# Altium schematic sheet UPCNSL-ABS-FLS-POL_test-v1.0.SchDoc
size A2
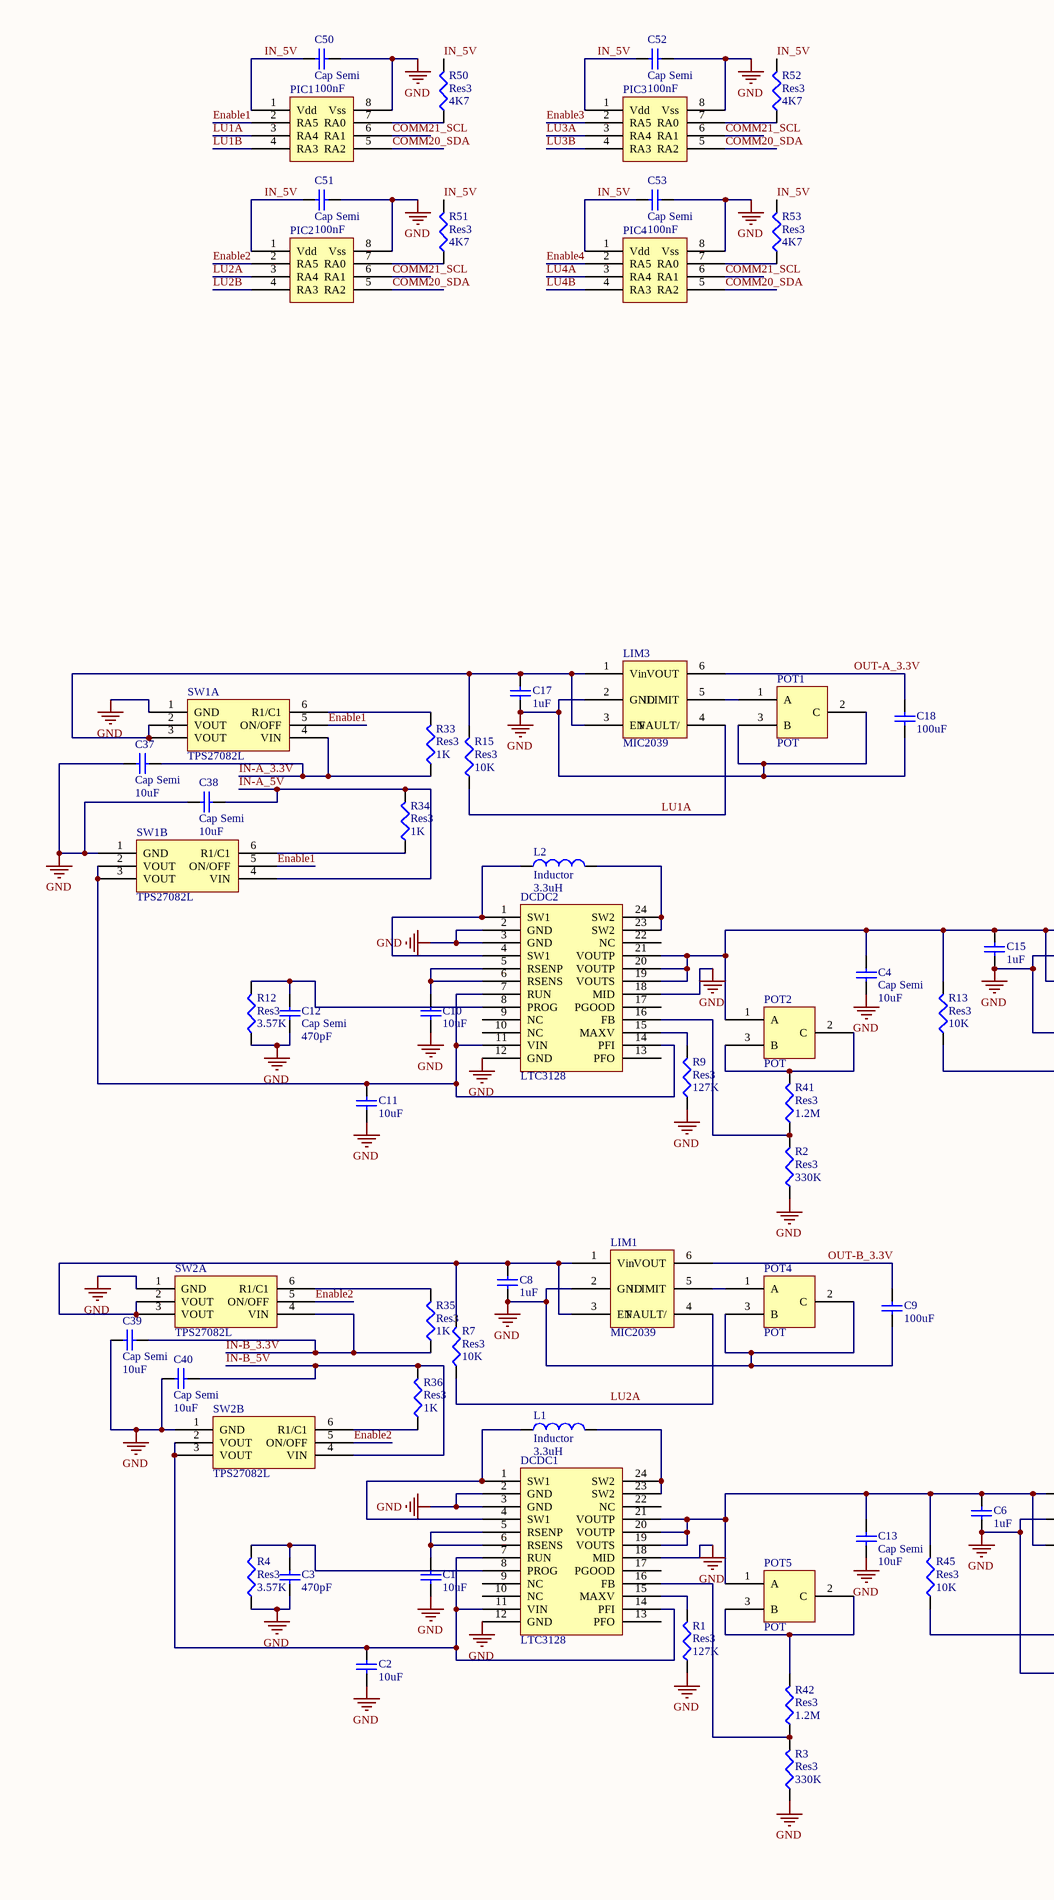
[diagram p0: UPCNSL-ABS-FLS-POL_test-v1.0.SchDoc, left]
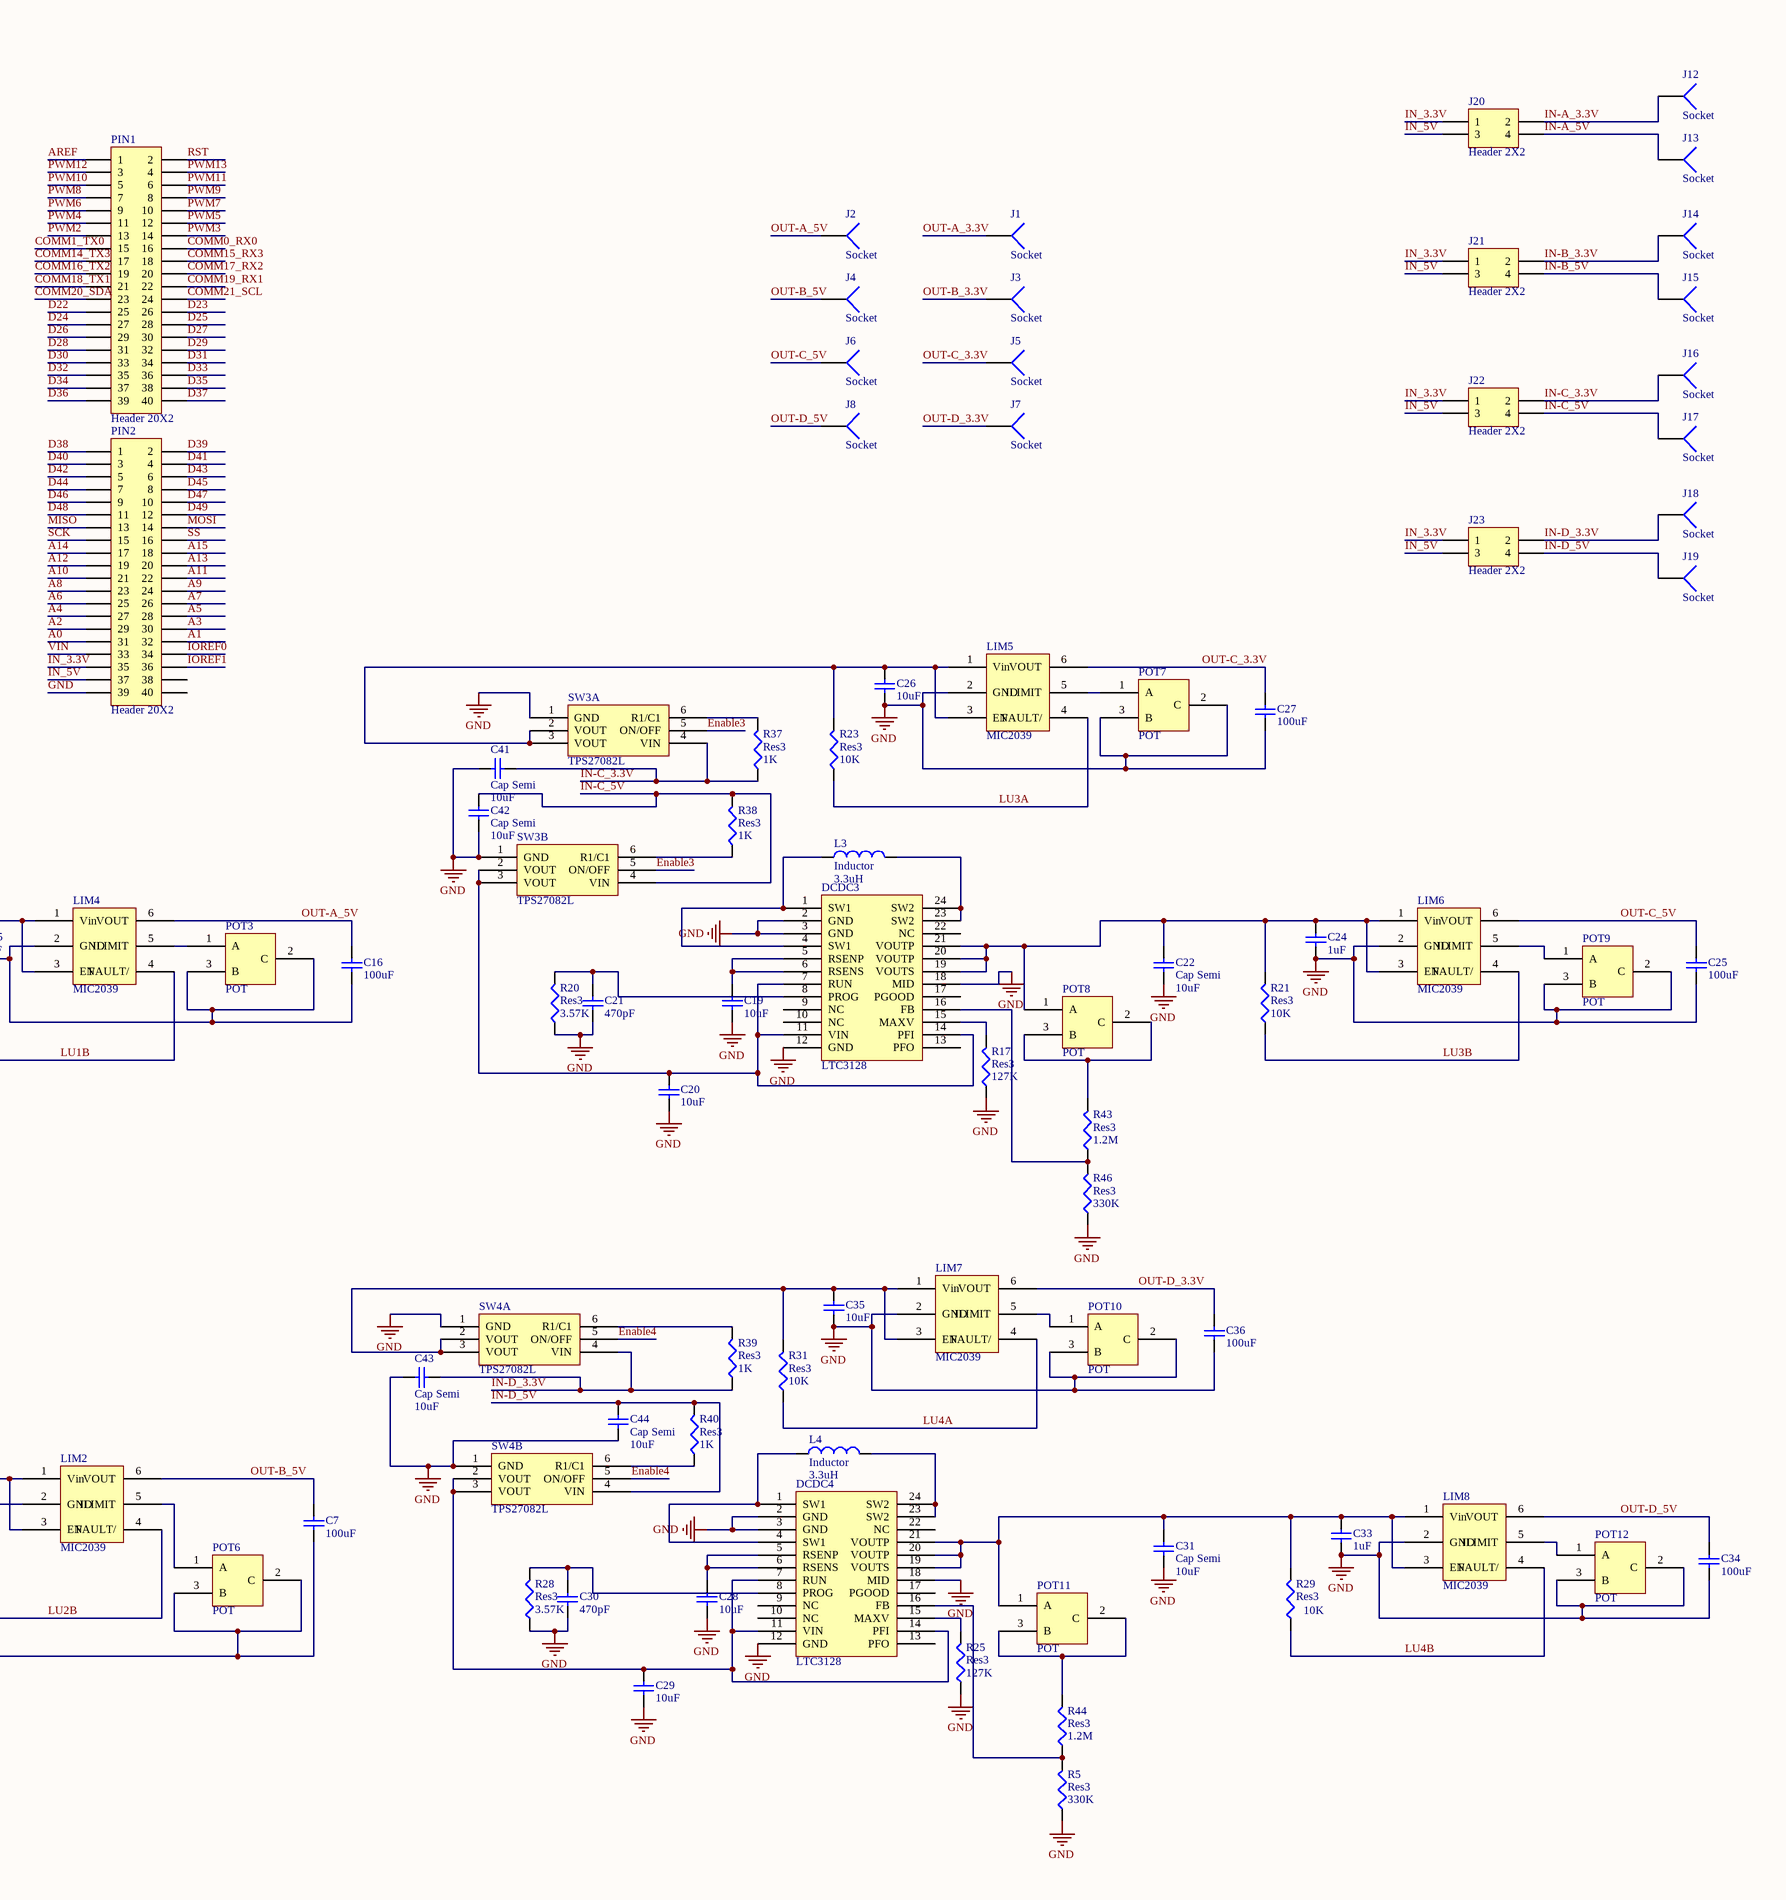
[diagram p1: UPCNSL-ABS-FLS-POL_test-v1.0.SchDoc, right]

## Parts
C1  value 10uF  [CAP0603]  (hidden comment: CAP0603)
C2  value 10uF  [CAP0603]  (hidden comment: CAP0603)
C3  value 470pF  [CAP0603]  (hidden comment: CAP0603)
C4  Cap Semi  value 10uF  [1608[0603]]
C6  value 1uF  [CAP0603]  (hidden comment: CAP0603)
C7  value 100uF  [CAP0603]  (hidden comment: CAP0603)
C8  value 1uF  [CAP0603]  (hidden comment: CAP0603)
C9  value 100uF  [CAP0603]  (hidden comment: CAP0603)
C10  value 10uF  [CAP0603]  (hidden comment: CAP0603)
C11  value 10uF  [CAP0603]  (hidden comment: CAP0603)
C12  Cap Semi  value 470pF  [1608[0603]]
C13  Cap Semi  value 10uF  [1608[0603]]
C15  value 1uF  [CAP0603]  (hidden comment: CAP0603)
C16  value 100uF  [CAP0603]  (hidden comment: CAP0603)
C17  value 1uF  [CAP0603]  (hidden comment: CAP0603)
C18  value 100uF  [CAP0603]  (hidden comment: CAP0603)
C19  value 10uF  [CAP0603]  (hidden comment: CAP0603)
C20  value 10uF  [CAP0603]  (hidden comment: CAP0603)
C21  value 470pF  [CAP0603]  (hidden comment: CAP0603)
C22  Cap Semi  value 10uF  [1608[0603]]
C24  value 1uF  [CAP0603]  (hidden comment: CAP0603)
C25  value 100uF  [CAP0603]  (hidden comment: CAP0603)
C26  value 10uF  [CAP0603]  (hidden comment: CAP0603)
C27  value 100uF  [CAP0603]  (hidden comment: CAP0603)
C28  value 10uF  [CAP0603]  (hidden comment: CAP0603)
C29  value 10uF  [CAP0603]  (hidden comment: CAP0603)
C30  value 470pF  [CAP0603]  (hidden comment: CAP0603)
C31  Cap Semi  value 10uF  [1608[0603]]
C33  value 1uF  [CAP0603]  (hidden comment: CAP0603)
C34  value 100uF  [CAP0603]  (hidden comment: CAP0603)
C35  value 10uF  [CAP0603]  (hidden comment: CAP0603)
C36  value 100uF  [CAP0603]  (hidden comment: CAP0603)
C37  Cap Semi  value 10uF  [1608[0603]]
C38  Cap Semi  value 10uF  [1608[0603]]
C39  Cap Semi  value 10uF  [1608[0603]]
C40  Cap Semi  value 10uF  [1608[0603]]
C41  Cap Semi  value 10uF  [1608[0603]]
C42  Cap Semi  value 10uF  [1608[0603]]
C43  Cap Semi  value 10uF  [1608[0603]]
C44  Cap Semi  value 10uF  [1608[0603]]
C50  Cap Semi  value 100nF  [1608[0603]]
C51  Cap Semi  value 100nF  [1608[0603]]
C52  Cap Semi  value 100nF  [1608[0603]]
C53  Cap Semi  value 100nF  [1608[0603]]
DCDC1  LTC3128  [SOP-24]
DCDC2  LTC3128  [SOP-24]
DCDC3  LTC3128  [SOP-24]
DCDC4  LTC3128  [SOP-24]
J1  Socket  [PIN1]
J2  Socket  [PIN1]
J3  Socket  [PIN1]
J4  Socket  [PIN1]
J5  Socket  [PIN1]
J6  Socket  [PIN1]
J7  Socket  [PIN1]
J8  Socket  [PIN1]
J12  Socket  [PIN1]
J13  Socket  [PIN1]
J14  Socket  [PIN1]
J15  Socket  [PIN1]
J16  Socket  [PIN1]
J17  Socket  [PIN1]
J18  Socket  [PIN1]
J19  Socket  [PIN1]
J20  Header 2X2  [HDR2X2]
J21  Header 2X2  [HDR2X2]
J22  Header 2X2  [HDR2X2]
J23  Header 2X2  [HDR2X2]
L1  Inductor  value 3.3uH  [MPLC0703R3]
L2  Inductor  value 3.3uH  [MPLC0703R3]
L3  Inductor  value 3.3uH  [MPLC0703R3]
L4  Inductor  value 3.3uH  [MPLC0703R3]
LIM1  MIC2039  [SOT23-6_M]
LIM2  MIC2039  [SOT23-6_M]
LIM3  MIC2039  [SOT23-6_M]
LIM4  MIC2039  [SOT23-6_M]
LIM5  MIC2039  [SOT23-6_M]
LIM6  MIC2039  [SOT23-6_M]
LIM7  MIC2039  [SOT23-6_M]
LIM8  MIC2039  [SOT23-6_M]
PIC1  SOCOL-8P  [SOCOL-8P]  (value not drawn)
PIC2  SOCOL-8P  [SOCOL-8P]  (value not drawn)
PIC3  SOCOL-8P  [SOCOL-8P]  (value not drawn)
PIC4  SOCOL-8P  [SOCOL-8P]  (value not drawn)
PIN1  Header 20X2  [HDR2X20]
PIN2  Header 20X2  [HDR2X20]
POT1  POT  [POT]
POT2  POT  [POT2]
POT3  POT  [POT]
POT4  POT  [POT]
POT5  POT  [POT2]
POT6  POT  [POT]
POT7  POT  [POT]
POT8  POT  [POT2]
POT9  POT  [POT]
POT10  POT  [POT]
POT11  POT  [POT2]
POT12  POT  [POT]
R1  Res3  value 127K  [J1-0603]
R2  Res3  value 330K  [J1-0603]
R3  Res3  value 330K  [J1-0603]
R4  Res3  value 3.57K  [J1-0603]
R5  Res3  value 330K  [J1-0603]
R7  Res3  value 10K  [J1-0603]
R9  Res3  value 127K  [J1-0603]
R12  Res3  value 3.57K  [J1-0603]
R13  Res3  value 10K  [J1-0603]
R15  Res3  value 10K  [J1-0603]
R17  Res3  value 127K  [J1-0603]
R20  Res3  value 3.57K  [J1-0603]
R21  Res3  value 10K  [J1-0603]
R23  Res3  value 10K  [J1-0603]
R25  Res3  value 127K  [J1-0603]
R28  Res3  value 3.57K  [J1-0603]
R29  Res3  value 10K  [J1-0603]
R31  Res3  value 10K  [J1-0603]
R33  Res3  value 1K  [J1-0603]
R34  Res3  value 1K  [J1-0603]
R35  Res3  value 1K  [J1-0603]
R36  Res3  value 1K  [J1-0603]
R37  Res3  value 1K  [J1-0603]
R38  Res3  value 1K  [J1-0603]
R39  Res3  value 1K  [J1-0603]
R40  Res3  value 1K  [J1-0603]
R41  Res3  value 1.2M  [J1-0603]
R42  Res3  value 1.2M  [J1-0603]
R43  Res3  value 1.2M  [J1-0603]
R44  Res3  value 1.2M  [J1-0603]
R45  Res3  value 10K  [J1-0603]
R46  Res3  value 330K  [J1-0603]
R50  Res3  value 4K7  [J1-0603]
R51  Res3  value 4K7  [J1-0603]
R52  Res3  value 4K7  [J1-0603]
R53  Res3  value 4K7  [J1-0603]
SW1A  TPS27082L  [TPS27081A]
SW1B  TPS27082L  [TPS27081A]
SW2A  TPS27082L  [TPS27081A]
SW2B  TPS27082L  [TPS27081A]
SW3A  TPS27082L  [TPS27081A]
SW3B  TPS27082L  [TPS27081A]
SW4A  TPS27082L  [TPS27081A]
SW4B  TPS27082L  [TPS27081A]

## Nets
GND: C1.2 C2.2 C3.2 C4.1 C6.2 C7.2 C8.2 C9.2 C10.2 C11.2 C12.1 C13.1 C15.2 C16.2 C17.2 C18.2 C19.2 C20.2 C21.2 C22.1 C24.2 C25.2 C26.2 C27.2 C28.2 C29.2 C30.2 C31.1 C33.2 C34.2 C35.2 C36.2 C37.1 C38.1 C39.1 C40.1 C41.2 C42.2 C43.1 C44.1 C50.2 C51.2 C52.2 C53.2 DCDC1.2(GND) DCDC1.3(GND) DCDC1.12(GND) DCDC1.18(MID) DCDC2.2(GND) DCDC2.3(GND) DCDC2.12(GND) DCDC2.18(MID) DCDC3.2(GND) DCDC3.3(GND) DCDC3.12(GND) DCDC3.18(MID) DCDC4.2(GND) DCDC4.3(GND) DCDC4.12(GND) DCDC4.18(MID) LIM1.2(GND) LIM2.2(GND) LIM3.2(GND) LIM4.2(GND) LIM5.2(GND) LIM6.2(GND) LIM7.2(GND) LIM8.2(GND) PIC1.8(Vss) PIC2.8(Vss) PIC3.8(Vss) PIC4.8(Vss) PIN2.39 POT1.2(C) POT1.3(B) POT3.2(C) POT3.3(B) POT4.2(C) POT4.3(B) POT6.2(C) POT6.3(B) POT7.2(C) POT7.3(B) POT9.2(C) POT9.3(B) POT10.2(C) POT10.3(B) POT12.2(C) POT12.3(B) R1.1 R2.1 R3.1 R4.1 R5.1 R9.1 R12.1 R17.1 R20.1 R25.1 R28.1 R46.1 SW1A.1(GND) SW1B.1(GND) SW2A.1(GND) SW2B.1(GND) SW3A.1(GND) SW3B.1(GND) SW4A.1(GND) SW4B.1(GND)
A0: PIN2.31
A1: PIN2.32
A2: PIN2.29
A3: PIN2.30
A4: PIN2.27
A5: PIN2.28
A6: PIN2.25
A7: PIN2.26
A8: PIN2.23
A9: PIN2.24
A10: PIN2.21
A11: PIN2.22
A12: PIN2.19
A13: PIN2.20
A14: PIN2.17
A15: PIN2.18
AREF: PIN1.1
COMM0_RX0: PIN1.16
COMM1_TX0: PIN1.15
COMM14_TX3: PIN1.17
COMM15_RX3: PIN1.18
COMM16_TX2: PIN1.19
COMM17_RX2: PIN1.20
COMM18_TX1: PIN1.21
COMM19_RX1: PIN1.22
COMM20_SDA: PIC1.5(RA2) PIC2.5(RA2) PIC3.5(RA2) PIC4.5(RA2) PIN1.23
COMM21_SCL: PIC1.6(RA1) PIC2.6(RA1) PIC3.6(RA1) PIC4.6(RA1) PIN1.24
D22: PIN1.25
D23: PIN1.26
D24: PIN1.27
D25: PIN1.28
D26: PIN1.29
D27: PIN1.30
D28: PIN1.31
D29: PIN1.32
D30: PIN1.33
D31: PIN1.34
D32: PIN1.35
D33: PIN1.36
D34: PIN1.37
D35: PIN1.38
D36: PIN1.39
D37: PIN1.40
D38: PIN2.1
D39: PIN2.2
D40: PIN2.3
D41: PIN2.4
D42: PIN2.5
D43: PIN2.6
D44: PIN2.7
D45: PIN2.8
D46: PIN2.9
D47: PIN2.10
D48: PIN2.11
D49: PIN2.12
Enable1: PIC1.2(RA5) SW1A.5(ON/OFF) SW1B.5(ON/OFF)
Enable2: PIC2.2(RA5) SW2A.5(ON/OFF) SW2B.5(ON/OFF)
Enable3: PIC3.2(RA5) SW3A.5(ON/OFF) SW3B.5(ON/OFF)
Enable4: PIC4.2(RA5) SW4A.5(ON/OFF) SW4B.5(ON/OFF)
IN-A_3.3V: C37.2 J12.1 J20.2 R33.1 SW1A.4(VIN)
IN-A_5V: C38.2 J13.1 J20.4 R34.2 SW1B.4(VIN)
IN-B_3.3V: C39.2 J14.1 J21.2 R35.1 SW2A.4(VIN)
IN-B_5V: C40.2 J15.1 J21.4 R36.2 SW2B.4(VIN)
IN-C_3.3V: C41.1 J16.1 J22.2 R37.1 SW3A.4(VIN)
IN-C_5V: C42.1 J17.1 J22.4 R38.2 SW3B.4(VIN)
IN-D_3.3V: C43.2 J18.1 J23.2 R39.1 SW4A.4(VIN)
IN-D_5V: C44.2 J19.1 J23.4 R40.2 SW4B.4(VIN)
IN_3.3V: J20.1 J21.1 J22.1 J23.1 PIN2.35
IN_5V: C50.1 C51.1 C52.1 C53.1 J20.3 J21.3 J22.3 J23.3 PIC1.1(Vdd) PIC2.1(Vdd) PIC3.1(Vdd) PIC4.1(Vdd) PIN2.37 R50.2 R51.2 R52.2 R53.2
IOREF0: PIN2.34
IOREF1: PIN2.36
LU1A: LIM3.4(FAULT/) PIC1.3(RA4) R15.1
LU1B: LIM4.4(FAULT/) PIC1.4(RA3) R13.1
LU2A: LIM1.4(FAULT/) PIC2.3(RA4) R7.1
LU2B: LIM2.4(FAULT/) PIC2.4(RA3) R45.1
LU3A: LIM5.4(FAULT/) PIC3.3(RA4) R23.1
LU3B: LIM6.4(FAULT/) PIC3.4(RA3) R21.1
LU4A: LIM7.4(FAULT/) PIC4.3(RA4) R31.1
LU4B: LIM8.4(FAULT/) PIC4.4(RA3) R29.1
MISO: PIN2.13
MOSI: PIN2.14
OUT-A_3.3V: C18.1 J1.1 LIM3.6(VOUT)
OUT-A_5V: C16.1 J2.1 LIM4.6(VOUT)
OUT-B_3.3V: C9.1 J3.1 LIM1.6(VOUT)
OUT-B_5V: C7.1 J4.1 LIM2.6(VOUT)
OUT-C_3.3V: C27.1 J5.1 LIM5.6(VOUT)
OUT-C_5V: C25.1 J6.1 LIM6.6(VOUT)
OUT-D_3.3V: C36.1 J7.1 LIM7.6(VOUT)
OUT-D_5V: C34.1 J8.1 LIM8.6(VOUT)
PWM2: PIN1.13
PWM3: PIN1.14
PWM4: PIN1.11
PWM5: PIN1.12
PWM6: PIN1.9
PWM7: PIN1.10
PWM8: PIN1.7
PWM9: PIN1.8
PWM10: PIN1.5
PWM11: PIN1.6
PWM12: PIN1.3
PWM13: PIN1.4
RST: PIN1.2
SCK: PIN2.15
SS: PIN2.16
VIN: PIN2.33
NetC1_1: C1.1 DCDC1.5(RSENP) DCDC1.6(RSENS)
NetC2_1: C2.1 DCDC1.7(RUN) DCDC1.11(VIN) DCDC1.14(PFI) SW2B.2(VOUT) SW2B.3(VOUT)
NetC3_1: C3.1 DCDC1.8(PROG) R4.2
NetC4_2: C4.2 C15.1 DCDC2.19(VOUTS) DCDC2.20(VOUTP) DCDC2.21(VOUTP) LIM4.1(Vin) LIM4.3(EN) POT2.1(A) R13.2
NetC6_1: C6.1 C13.2 DCDC1.19(VOUTS) DCDC1.20(VOUTP) DCDC1.21(VOUTP) LIM2.1(Vin) LIM2.3(EN) POT5.1(A) R45.2
NetC8_1: C8.1 LIM1.1(Vin) LIM1.3(EN) R7.2 SW2A.2(VOUT) SW2A.3(VOUT)
NetC10_1: C10.1 DCDC2.5(RSENP) DCDC2.6(RSENS)
NetC11_1: C11.1 DCDC2.7(RUN) DCDC2.11(VIN) DCDC2.14(PFI) SW1B.2(VOUT) SW1B.3(VOUT)
NetC12_2: C12.2 DCDC2.8(PROG) R12.2
NetC17_1: C17.1 LIM3.1(Vin) LIM3.3(EN) R15.2 SW1A.2(VOUT) SW1A.3(VOUT)
NetC19_1: C19.1 DCDC3.5(RSENP) DCDC3.6(RSENS)
NetC20_1: C20.1 DCDC3.7(RUN) DCDC3.11(VIN) DCDC3.14(PFI) SW3B.2(VOUT) SW3B.3(VOUT)
NetC21_1: C21.1 DCDC3.8(PROG) R20.2
NetC22_2: C22.2 C24.1 DCDC3.19(VOUTS) DCDC3.20(VOUTP) DCDC3.21(VOUTP) LIM6.1(Vin) LIM6.3(EN) POT8.1(A) R21.2
NetC26_1: C26.1 LIM5.1(Vin) LIM5.3(EN) R23.2 SW3A.2(VOUT) SW3A.3(VOUT)
NetC28_1: C28.1 DCDC4.5(RSENP) DCDC4.6(RSENS)
NetC29_1: C29.1 DCDC4.7(RUN) DCDC4.11(VIN) DCDC4.14(PFI) SW4B.2(VOUT) SW4B.3(VOUT)
NetC30_1: C30.1 DCDC4.8(PROG) R28.2
NetC31_2: C31.2 C33.1 DCDC4.19(VOUTS) DCDC4.20(VOUTP) DCDC4.21(VOUTP) LIM8.1(Vin) LIM8.3(EN) POT11.1(A) R29.2
NetC35_1: C35.1 LIM7.1(Vin) LIM7.3(EN) R31.2 SW4A.2(VOUT) SW4A.3(VOUT)
NetDCDC1_1: DCDC1.1(SW1) DCDC1.4(SW1) L1.1
NetDCDC1_15: DCDC1.15(MAXV) R1.2
NetDCDC1_16: DCDC1.16(FB) R3.2 R42.1
NetDCDC1_23: DCDC1.23(SW2) DCDC1.24(SW2) L1.2
NetDCDC2_1: DCDC2.1(SW1) DCDC2.4(SW1) L2.1
NetDCDC2_15: DCDC2.15(MAXV) R9.2
NetDCDC2_16: DCDC2.16(FB) R2.2 R41.1
NetDCDC2_23: DCDC2.23(SW2) DCDC2.24(SW2) L2.2
NetDCDC3_1: DCDC3.1(SW1) DCDC3.4(SW1) L3.1
NetDCDC3_15: DCDC3.15(MAXV) R17.2
NetDCDC3_16: DCDC3.16(FB) R43.1 R46.2
NetDCDC3_23: DCDC3.23(SW2) DCDC3.24(SW2) L3.2
NetDCDC4_1: DCDC4.1(SW1) DCDC4.4(SW1) L4.1
NetDCDC4_15: DCDC4.15(MAXV) R25.2
NetDCDC4_16: DCDC4.16(FB) R5.2 R44.1
NetDCDC4_23: DCDC4.23(SW2) DCDC4.24(SW2) L4.2
NetLIM1_5: LIM1.5(ILIMIT) POT4.1(A)
NetLIM2_5: LIM2.5(ILIMIT) POT6.1(A)
NetLIM3_5: LIM3.5(ILIMIT) POT1.1(A)
NetLIM4_5: LIM4.5(ILIMIT) POT3.1(A)
NetLIM5_5: LIM5.5(ILIMIT) POT7.1(A)
NetLIM6_5: LIM6.5(ILIMIT) POT9.1(A)
NetLIM7_5: LIM7.5(ILIMIT) POT10.1(A)
NetLIM8_5: LIM8.5(ILIMIT) POT12.1(A)
NetPIC1_7: PIC1.7(RA0) R50.1
NetPIC2_7: PIC2.7(RA0) R51.1
NetPIC3_7: PIC3.7(RA0) R52.1
NetPIC4_7: PIC4.7(RA0) R53.1
NetPOT2_2: POT2.2(C) POT2.3(B) R41.2
NetPOT5_2: POT5.2(C) POT5.3(B) R42.2
NetPOT8_2: POT8.2(C) POT8.3(B) R43.2
NetPOT11_2: POT11.2(C) POT11.3(B) R44.2
NetR33_2: R33.2 SW1A.6(R1/C1)
NetR34_1: R34.1 SW1B.6(R1/C1)
NetR35_2: R35.2 SW2A.6(R1/C1)
NetR36_1: R36.1 SW2B.6(R1/C1)
NetR37_2: R37.2 SW3A.6(R1/C1)
NetR38_1: R38.1 SW3B.6(R1/C1)
NetR39_2: R39.2 SW4A.6(R1/C1)
NetR40_1: R40.1 SW4B.6(R1/C1)

Not connected (* = marked no-connect by the designer): DCDC1 9(NC) 10(NC) 13(PFO) 17(PGOOD) 22(NC); DCDC2 9(NC) 10(NC) 13(PFO) 17(PGOOD) 22(NC); DCDC3 9(NC) 10(NC) 13(PFO) 17(PGOOD) 22(NC); DCDC4 9(NC) 10(NC) 13(PFO) 17(PGOOD) 22(NC); PIN2 38 40

## Library data of the parts
C1-C3 C6-C11 C15-C21 C24-C30 C33-C36 = CAP0603: Capacitor
C4 C12 C13 C22 C31 C37-C44 C50-C53 = Cap Semi: Capacitor (Semiconductor SIM Model); Published: 8-Jun-2000; LatestRevisionDate: 29-May-2009; LatestRevisionNote: IPC-7351 Footprint Added.; PackageReference: C1206; Publisher: Altium Limited; PackageDescription: Chip Capacitor
DCDC1-DCDC4 = Component_1
J20-J23 = Header 2X2: Header, 2-Pin, Dual row; LatestRevisionDate: 17-Jul-2002; LatestRevisionNote: Re-released for DXP Platform.; Publisher: Altium Limited
L1-L4 = Inductor: Code_IEC: 1005; Published: 8-Jun-2000; LatestRevisionDate: 29-May-2009; LatestRevisionNote: IPC-7351 Footprint Added.; PackageReference: 0402-A; Publisher: Altium Limited; PackageDescription: Chip Inductor; Code_JEITA: 0402
PIN1 PIN2 = Header 20X2: Header, 20-Pin, Dual row; LatestRevisionDate: 17-Jul-2002; LatestRevisionNote: Re-released for DXP Platform.; Publisher: Altium Limited
POT1-POT12 = component_1
R1-R5 R7 R9 R12 R13 R15 R17 R20 R21 R23 R25 R28 R29 R31 R33-R46 R50-R53 = Res3: Resistor; Published: 8-Jun-2000; LatestRevisionDate: 29-May-2009; LatestRevisionNote: IPC-7351 Footprint Added.; PackageReference: J1-0603; Publisher: Altium Limited; PackageDescription: Chip Resistor
J1-J8 J12-J19 = Socket: LatestRevisionDate: 17-Jul-2002; LatestRevisionNote: Re-released for DXP Platform.; Publisher: Altium Limited